# Altium schematic sheet MODBUS_Interface_Board__03.SchDoc
size A4
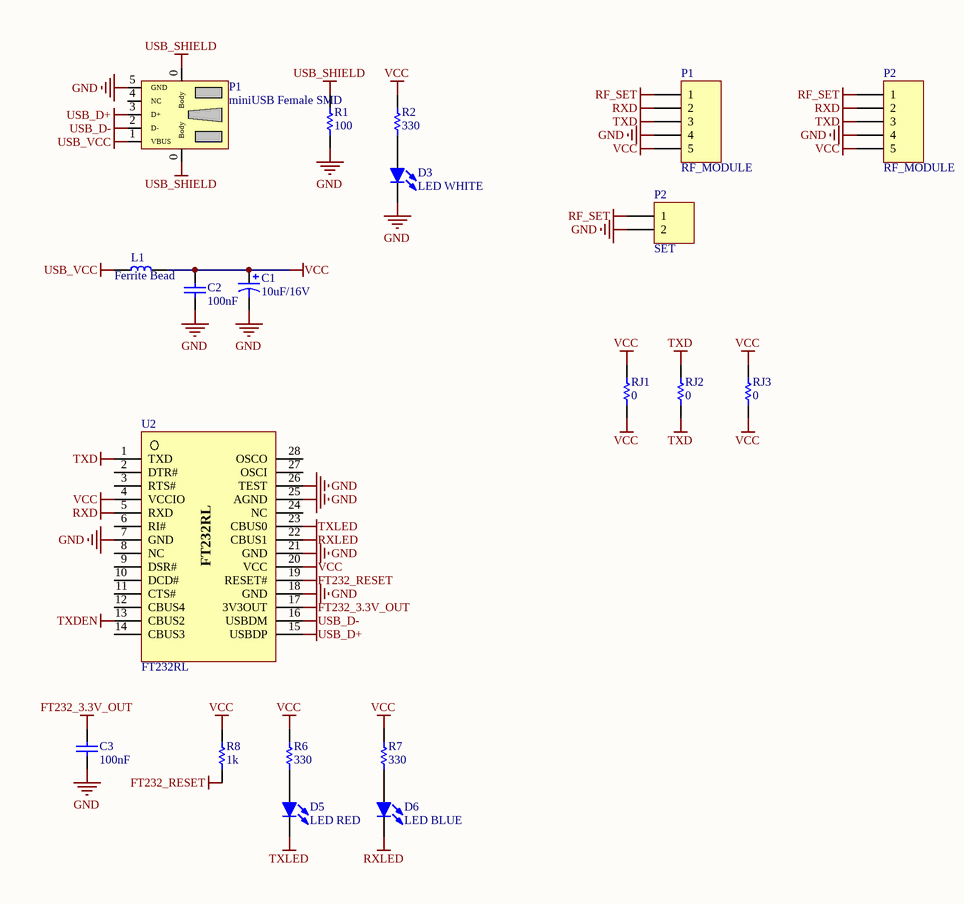
[diagram p0: MODBUS_Interface_Board__03.SchDoc]

## Parts
(Parts that share a designator on the sheet are numbered #1, #2 ... from top to bottom, then left to right.)
C1  10uF/16V  [RB.2/.4_p]
C2  100nF  [0805_smd]
C3  100nF  [0805_smd]
D3  LED WHITE  [0603 SMD LED]
D5  LED RED  [0603 SMD LED]
D6  LED BLUE  [0603 SMD LED]
L1  Ferrite Bead  [1206_SMD]
P1#1  miniUSB Female SMD  [miniUSB SMD]
P1#2  RF_MODULE  [HDR1X5]
P2#1  RF_MODULE  [HDR1X5]
P2#2  SET  [HDR1X2]
R1  100  [0805_smd]
R2  330  [0805_smd]
R6  330  [0805_smd]
R7  330  [0805_smd]
R8  1k  [0805_smd]
RJ1  0  [1206_SMD]
RJ2  0  [1206_SMD]
RJ3  0  [1206_SMD]
U2  FT232RL  [SSOP-28]

## Nets
FT232_3.3V_OUT: C3.1 U2.17(3V3OUT)
FT232_RESET: R8.1 U2.19(RESET#)
GND: C1.2 C2.2 C3.2 D3.K P1#1.5(GND) P1#2.4 P2#1.4 P2#2.2 R1.1 U2.7(GND) U2.18(GND) U2.21(GND) U2.25(AGND) U2.26(TEST)
RF_SET: P1#2.1 P2#1.1 P2#2.1
RXD: P1#2.2 P2#1.2 U2.5(RXD)
RXLED: D6.K U2.22(CBUS1)
TXD: P1#2.3 P2#1.3 RJ2.1 RJ2.2 U2.1(TXD)
TXDEN: U2.13(CBUS2)
TXLED: D5.K U2.23(CBUS0)
USB_D+: P1#1.3(D+) U2.15(USBDP)
USB_D-: P1#1.2(D-) U2.16(USBDM)
USB_SHIELD: P1#1.0(Body) R1.2
USB_VCC: L1.1 P1#1.1(VBUS)
VCC: C1.1 C2.1 L1.2 P1#2.5 P2#1.5 R2.2 R6.2 R7.2 R8.2 RJ1.1 RJ1.2 RJ3.1 RJ3.2 U2.4(VCCIO) U2.20(VCC)
NetD3_A: D3.A R2.1
NetD5_A: D5.A R6.1
NetD6_A: D6.A R7.1

Not connected (* = marked no-connect by the designer): P1#1 4(NC); U2 2(DTR#) 3(RTS#) 6(RI#) 8(NC) 9(DSR#) 10(DCD#) 11(CTS#) 12(CBUS4) 14(CBUS3) 24(NC) 27(OSCI) 28(OSCO)

## Library data of the parts
C1 = Cap Pol1: Polarized Capacitor (Radial); Value: 100pF; Published: 8-Jun-2000; LatestRevisionDate: 17-Jul-2002; LatestRevisionNote: Re-released for DXP Platform.; PackageReference: RB7.6-15; Publisher: Altium Limited
C2 C3 = Cap: Capacitor; Published: 8-Jun-2000; LatestRevisionDate: 17-Jul-2002; LatestRevisionNote: Re-released for DXP Platform.; PackageReference: RAD-0.3; Publisher: Altium Limited; PackageDescription: Radial Cap, Thru-Hole; 2 Leads; 0.3 in Pin Spacing; Value: 100nF
D3 D5 D6 = LED
L1 = Inductor
P1#1 = miniUSB
P1#2 P2#1 = Header 5: Header, 5-Pin; LatestRevisionDate: 17-Jul-2002; LatestRevisionNote: Re-released for DXP Platform.; Publisher: Altium Limited
P2#2 = Header 2: Header, 2-Pin; LatestRevisionDate: 17-Jul-2002; LatestRevisionNote: Re-released for DXP Platform.; Publisher: Altium Limited
R1 R2 R6-R8 RJ1-RJ3 = Res1: Resistor; Published: 8-Jun-2000; LatestRevisionDate: 17-Jul-2002; LatestRevisionNote: Re-released for DXP Platform.; PackageReference: AXIAL-0.3; Publisher: Altium Limited
  R1: Value: 100
  R2 R6 R7: Value: 330
  R8: Value: 1k
  RJ1-RJ3: Value: 0